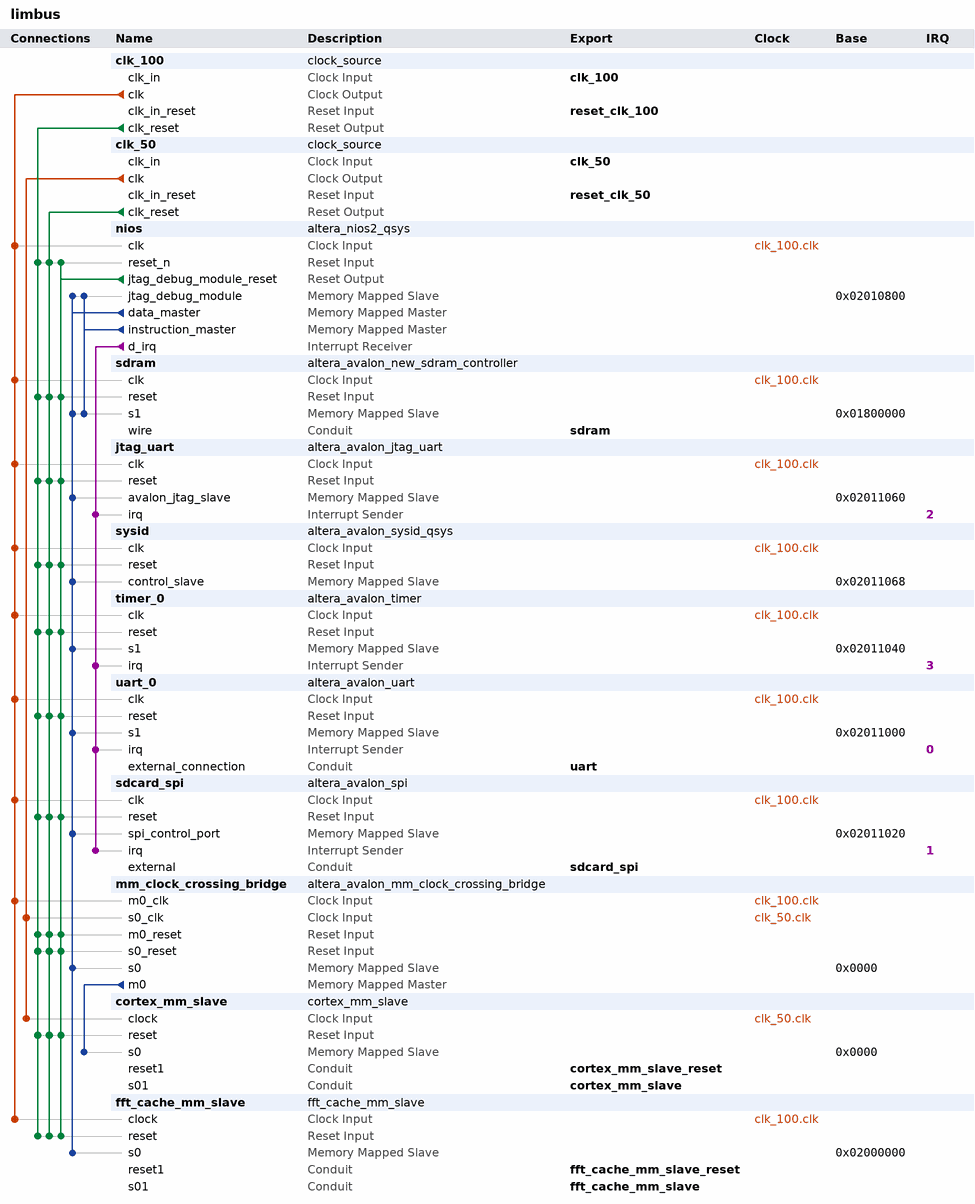
[diagram p0: system contents]
# Platform Designer (Qsys) system limbus
# Parameters at their usual value, and those the tool derives, are not listed.
package require -exact qsys 11.1
create_system limbus
set_project_property DEVICE_FAMILY CYCLONEII

add_instance clk_100 clock_source 11.1
set_instance_parameter_value clk_100 clockFrequency 100000000

add_instance clk_50 clock_source 11.1
set_instance_parameter_value clk_50 clockFrequency 50000000

add_instance nios altera_nios2_qsys 11.1
set_instance_parameter_value nios resetSlave sdram.s1
set_instance_parameter_value nios exceptionSlave sdram.s1
set_instance_parameter_value nios breakSlave nios.jtag_debug_module
set_instance_parameter_value nios impl Tiny
set_instance_parameter_value nios icache_size 4096

add_instance sdram altera_avalon_new_sdram_controller 11.1
set_instance_parameter_value sdram TAC 5.5
set_instance_parameter_value sdram TRCD 20.0
set_instance_parameter_value sdram TRP 20.0
set_instance_parameter_value sdram casLatency 3
set_instance_parameter_value sdram columnWidth 8
set_instance_parameter_value sdram dataWidth 16
set_instance_parameter_value sdram generateSimulationModel false
set_instance_parameter_value sdram model custom
set_instance_parameter_value sdram numberOfBanks 4
set_instance_parameter_value sdram numberOfChipSelects 1
set_instance_parameter_value sdram powerUpDelay 100.0
set_instance_parameter_value sdram refreshPeriod 15.625
set_instance_parameter_value sdram rowWidth 12

add_instance jtag_uart altera_avalon_jtag_uart 11.1
set_instance_parameter_value jtag_uart simInteractiveOptions INTERACTIVE_ASCII_OUTPUT

add_instance sysid altera_avalon_sysid_qsys 11.1
set_instance_parameter_value sysid id 1

add_instance timer_0 altera_avalon_timer 11.1
set_instance_parameter_value timer_0 period 1
set_instance_parameter_value timer_0 periodUnits MSEC
set_instance_parameter_value timer_0 timerPreset CUSTOM

add_instance uart_0 altera_avalon_uart 11.1
set_instance_parameter_value uart_0 baud 115200
set_instance_parameter_value uart_0 dataBits 8
set_instance_parameter_value uart_0 fixedBaud true
set_instance_parameter_value uart_0 parity NONE
set_instance_parameter_value uart_0 stopBits 1

add_instance sdcard_spi altera_avalon_spi 11.1
set_instance_parameter_value sdcard_spi clockPolarity 0
set_instance_parameter_value sdcard_spi dataWidth 8
set_instance_parameter_value sdcard_spi masterSPI true
set_instance_parameter_value sdcard_spi numberOfSlaves 1
set_instance_parameter_value sdcard_spi targetClockRate 128000

add_instance mm_clock_crossing_bridge altera_avalon_mm_clock_crossing_bridge 11.1
set_instance_parameter_value mm_clock_crossing_bridge DATA_WIDTH 32
set_instance_parameter_value mm_clock_crossing_bridge ADDRESS_WIDTH 18
set_instance_parameter_value mm_clock_crossing_bridge ADDRESS_UNITS WORDS
set_instance_parameter_value mm_clock_crossing_bridge MAX_BURST_SIZE 1
set_instance_parameter_value mm_clock_crossing_bridge COMMAND_FIFO_DEPTH 4
set_instance_parameter_value mm_clock_crossing_bridge RESPONSE_FIFO_DEPTH 4
set_instance_parameter_value mm_clock_crossing_bridge MASTER_SYNC_DEPTH 2
set_instance_parameter_value mm_clock_crossing_bridge SLAVE_SYNC_DEPTH 2

add_instance cortex_mm_slave cortex_mm_slave 1.0

add_instance fft_cache_mm_slave fft_cache_mm_slave 1.0

# connections
add_connection clk_50.clk cortex_mm_slave.clock clock
add_connection clk_50.clk mm_clock_crossing_bridge.s0_clk clock
add_connection clk_100.clk fft_cache_mm_slave.clock clock
add_connection clk_100.clk jtag_uart.clk clock
add_connection clk_100.clk mm_clock_crossing_bridge.m0_clk clock
add_connection clk_100.clk nios.clk clock
add_connection clk_100.clk sdcard_spi.clk clock
add_connection clk_100.clk sdram.clk clock
add_connection clk_100.clk sysid.clk clock
add_connection clk_100.clk timer_0.clk clock
add_connection clk_100.clk uart_0.clk clock
add_connection clk_50.clk_reset cortex_mm_slave.reset reset
add_connection clk_50.clk_reset fft_cache_mm_slave.reset reset
add_connection clk_50.clk_reset jtag_uart.reset reset
add_connection clk_50.clk_reset mm_clock_crossing_bridge.m0_reset reset
add_connection clk_50.clk_reset mm_clock_crossing_bridge.s0_reset reset
add_connection clk_50.clk_reset nios.reset_n reset
add_connection clk_50.clk_reset sdcard_spi.reset reset
add_connection clk_50.clk_reset sdram.reset reset
add_connection clk_50.clk_reset sysid.reset reset
add_connection clk_50.clk_reset timer_0.reset reset
add_connection clk_50.clk_reset uart_0.reset reset
add_connection clk_100.clk_reset cortex_mm_slave.reset reset
add_connection clk_100.clk_reset fft_cache_mm_slave.reset reset
add_connection clk_100.clk_reset jtag_uart.reset reset
add_connection clk_100.clk_reset mm_clock_crossing_bridge.m0_reset reset
add_connection clk_100.clk_reset mm_clock_crossing_bridge.s0_reset reset
add_connection clk_100.clk_reset nios.reset_n reset
add_connection clk_100.clk_reset sdcard_spi.reset reset
add_connection clk_100.clk_reset sdram.reset reset
add_connection clk_100.clk_reset sysid.reset reset
add_connection clk_100.clk_reset timer_0.reset reset
add_connection clk_100.clk_reset uart_0.reset reset
add_connection nios.jtag_debug_module_reset cortex_mm_slave.reset reset
add_connection nios.jtag_debug_module_reset fft_cache_mm_slave.reset reset
add_connection nios.jtag_debug_module_reset jtag_uart.reset reset
add_connection nios.jtag_debug_module_reset mm_clock_crossing_bridge.m0_reset reset
add_connection nios.jtag_debug_module_reset mm_clock_crossing_bridge.s0_reset reset
add_connection nios.jtag_debug_module_reset nios.reset_n reset
add_connection nios.jtag_debug_module_reset sdcard_spi.reset reset
add_connection nios.jtag_debug_module_reset sdram.reset reset
add_connection nios.jtag_debug_module_reset sysid.reset reset
add_connection nios.jtag_debug_module_reset timer_0.reset reset
add_connection nios.jtag_debug_module_reset uart_0.reset reset
add_connection mm_clock_crossing_bridge.m0 cortex_mm_slave.s0 avalon
set_connection_parameter_value mm_clock_crossing_bridge.m0/cortex_mm_slave.s0 baseAddress 0x0000
add_connection nios.data_master fft_cache_mm_slave.s0 avalon
set_connection_parameter_value nios.data_master/fft_cache_mm_slave.s0 baseAddress 0x02000000
add_connection nios.data_master jtag_uart.avalon_jtag_slave avalon
set_connection_parameter_value nios.data_master/jtag_uart.avalon_jtag_slave baseAddress 0x02011060
add_connection nios.data_master mm_clock_crossing_bridge.s0 avalon
set_connection_parameter_value nios.data_master/mm_clock_crossing_bridge.s0 baseAddress 0x0000
add_connection nios.data_master nios.jtag_debug_module avalon
set_connection_parameter_value nios.data_master/nios.jtag_debug_module baseAddress 0x02010800
add_connection nios.data_master sdcard_spi.spi_control_port avalon
set_connection_parameter_value nios.data_master/sdcard_spi.spi_control_port baseAddress 0x02011020
add_connection nios.data_master sdram.s1 avalon
set_connection_parameter_value nios.data_master/sdram.s1 baseAddress 0x01800000
add_connection nios.data_master sysid.control_slave avalon
set_connection_parameter_value nios.data_master/sysid.control_slave baseAddress 0x02011068
add_connection nios.data_master timer_0.s1 avalon
set_connection_parameter_value nios.data_master/timer_0.s1 baseAddress 0x02011040
add_connection nios.data_master uart_0.s1 avalon
set_connection_parameter_value nios.data_master/uart_0.s1 baseAddress 0x02011000
add_connection nios.instruction_master nios.jtag_debug_module avalon
set_connection_parameter_value nios.instruction_master/nios.jtag_debug_module baseAddress 0x02010800
add_connection nios.instruction_master sdram.s1 avalon
set_connection_parameter_value nios.instruction_master/sdram.s1 baseAddress 0x01800000
add_connection nios.d_irq jtag_uart.irq interrupt
set_connection_parameter_value nios.d_irq/jtag_uart.irq irqNumber 2
add_connection nios.d_irq sdcard_spi.irq interrupt
set_connection_parameter_value nios.d_irq/sdcard_spi.irq irqNumber 1
add_connection nios.d_irq timer_0.irq interrupt
set_connection_parameter_value nios.d_irq/timer_0.irq irqNumber 3
add_connection nios.d_irq uart_0.irq interrupt
set_connection_parameter_value nios.d_irq/uart_0.irq irqNumber 0

# exported interfaces
add_interface clk_50 clock sink
set_interface_property clk_50 EXPORT_OF clk_50.clk_in
add_interface reset_clk_50 reset sink
set_interface_property reset_clk_50 EXPORT_OF clk_50.clk_in_reset
add_interface clk_100 clock sink
set_interface_property clk_100 EXPORT_OF clk_100.clk_in
add_interface reset_clk_100 reset sink
set_interface_property reset_clk_100 EXPORT_OF clk_100.clk_in_reset
add_interface sdram conduit end
set_interface_property sdram EXPORT_OF sdram.wire
add_interface uart conduit end
set_interface_property uart EXPORT_OF uart_0.external_connection
add_interface sdcard_spi conduit end
set_interface_property sdcard_spi EXPORT_OF sdcard_spi.external
add_interface cortex_mm_slave conduit end
set_interface_property cortex_mm_slave EXPORT_OF cortex_mm_slave.s01
add_interface cortex_mm_slave_reset conduit end
set_interface_property cortex_mm_slave_reset EXPORT_OF cortex_mm_slave.reset1
add_interface fft_cache_mm_slave conduit end
set_interface_property fft_cache_mm_slave EXPORT_OF fft_cache_mm_slave.s01
add_interface fft_cache_mm_slave_reset conduit end
set_interface_property fft_cache_mm_slave_reset EXPORT_OF fft_cache_mm_slave.reset1

save_system limbus.qsys
